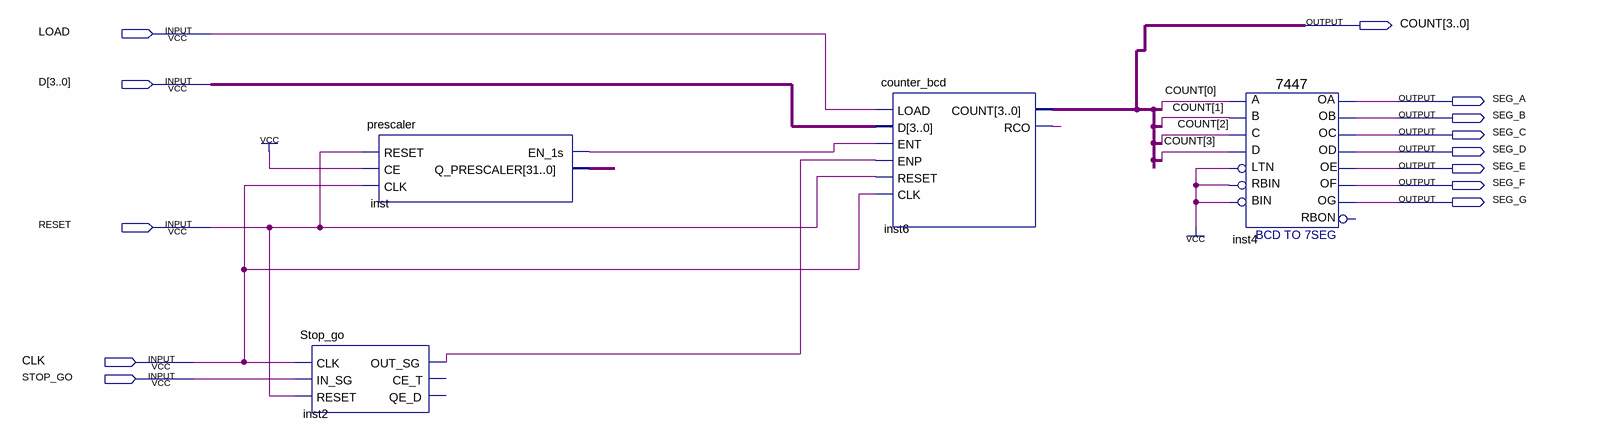
[diagram p0: schematic sheet]
// Quartus schematic PR4_GRPA1_P10.bdf as structural Verilog: 4 symbols, 13 pins
module PR4_GRPA1_P10 (
  input  LOAD,
  input  [3:0] D,
  input  RESET,
  input  CLK,
  input  STOP_GO,
  output [3:0] COUNT,
  output SEG_A,
  output SEG_B,
  output SEG_C,
  output SEG_D,
  output SEG_E,
  output SEG_F,
  output SEG_G
);

  wire inst2_out_sg, inst6_rco, inst_en_1s;
  wire [31:0] inst_q_prescaler;

  Stop_go inst2 (.CLK(CLK), .IN_SG(STOP_GO), .RESET(RESET), .OUT_SG(inst2_out_sg));  // open: CE_T, QE_D
  prescaler inst (.RESET(RESET), .CE(1'b1), .CLK(CLK), .EN_1s(inst_en_1s), .Q_PRESCALER(inst_q_prescaler));
  counter_bcd inst6 (
    .LOAD(LOAD), .D(D), .ENT(inst_en_1s), .ENP(inst2_out_sg), .RESET(RESET), .CLK(CLK), .COUNT(COUNT),
    .RCO(inst6_rco));
  \7447  inst4 (
    .LTN(1'b1), .B(COUNT[1]), .C(COUNT[2]), .D(COUNT[3]), .RBIN(1'b1), .BIN(1'b1), .A(COUNT[0]), .OB(SEG_B),
    .OC(SEG_C), .OE(SEG_E), .OD(SEG_D), .OF(SEG_F), .OG(SEG_G), .OA(SEG_A));  // open: RBON
endmodule
